# Altium project USB-ETH.PrjPcb
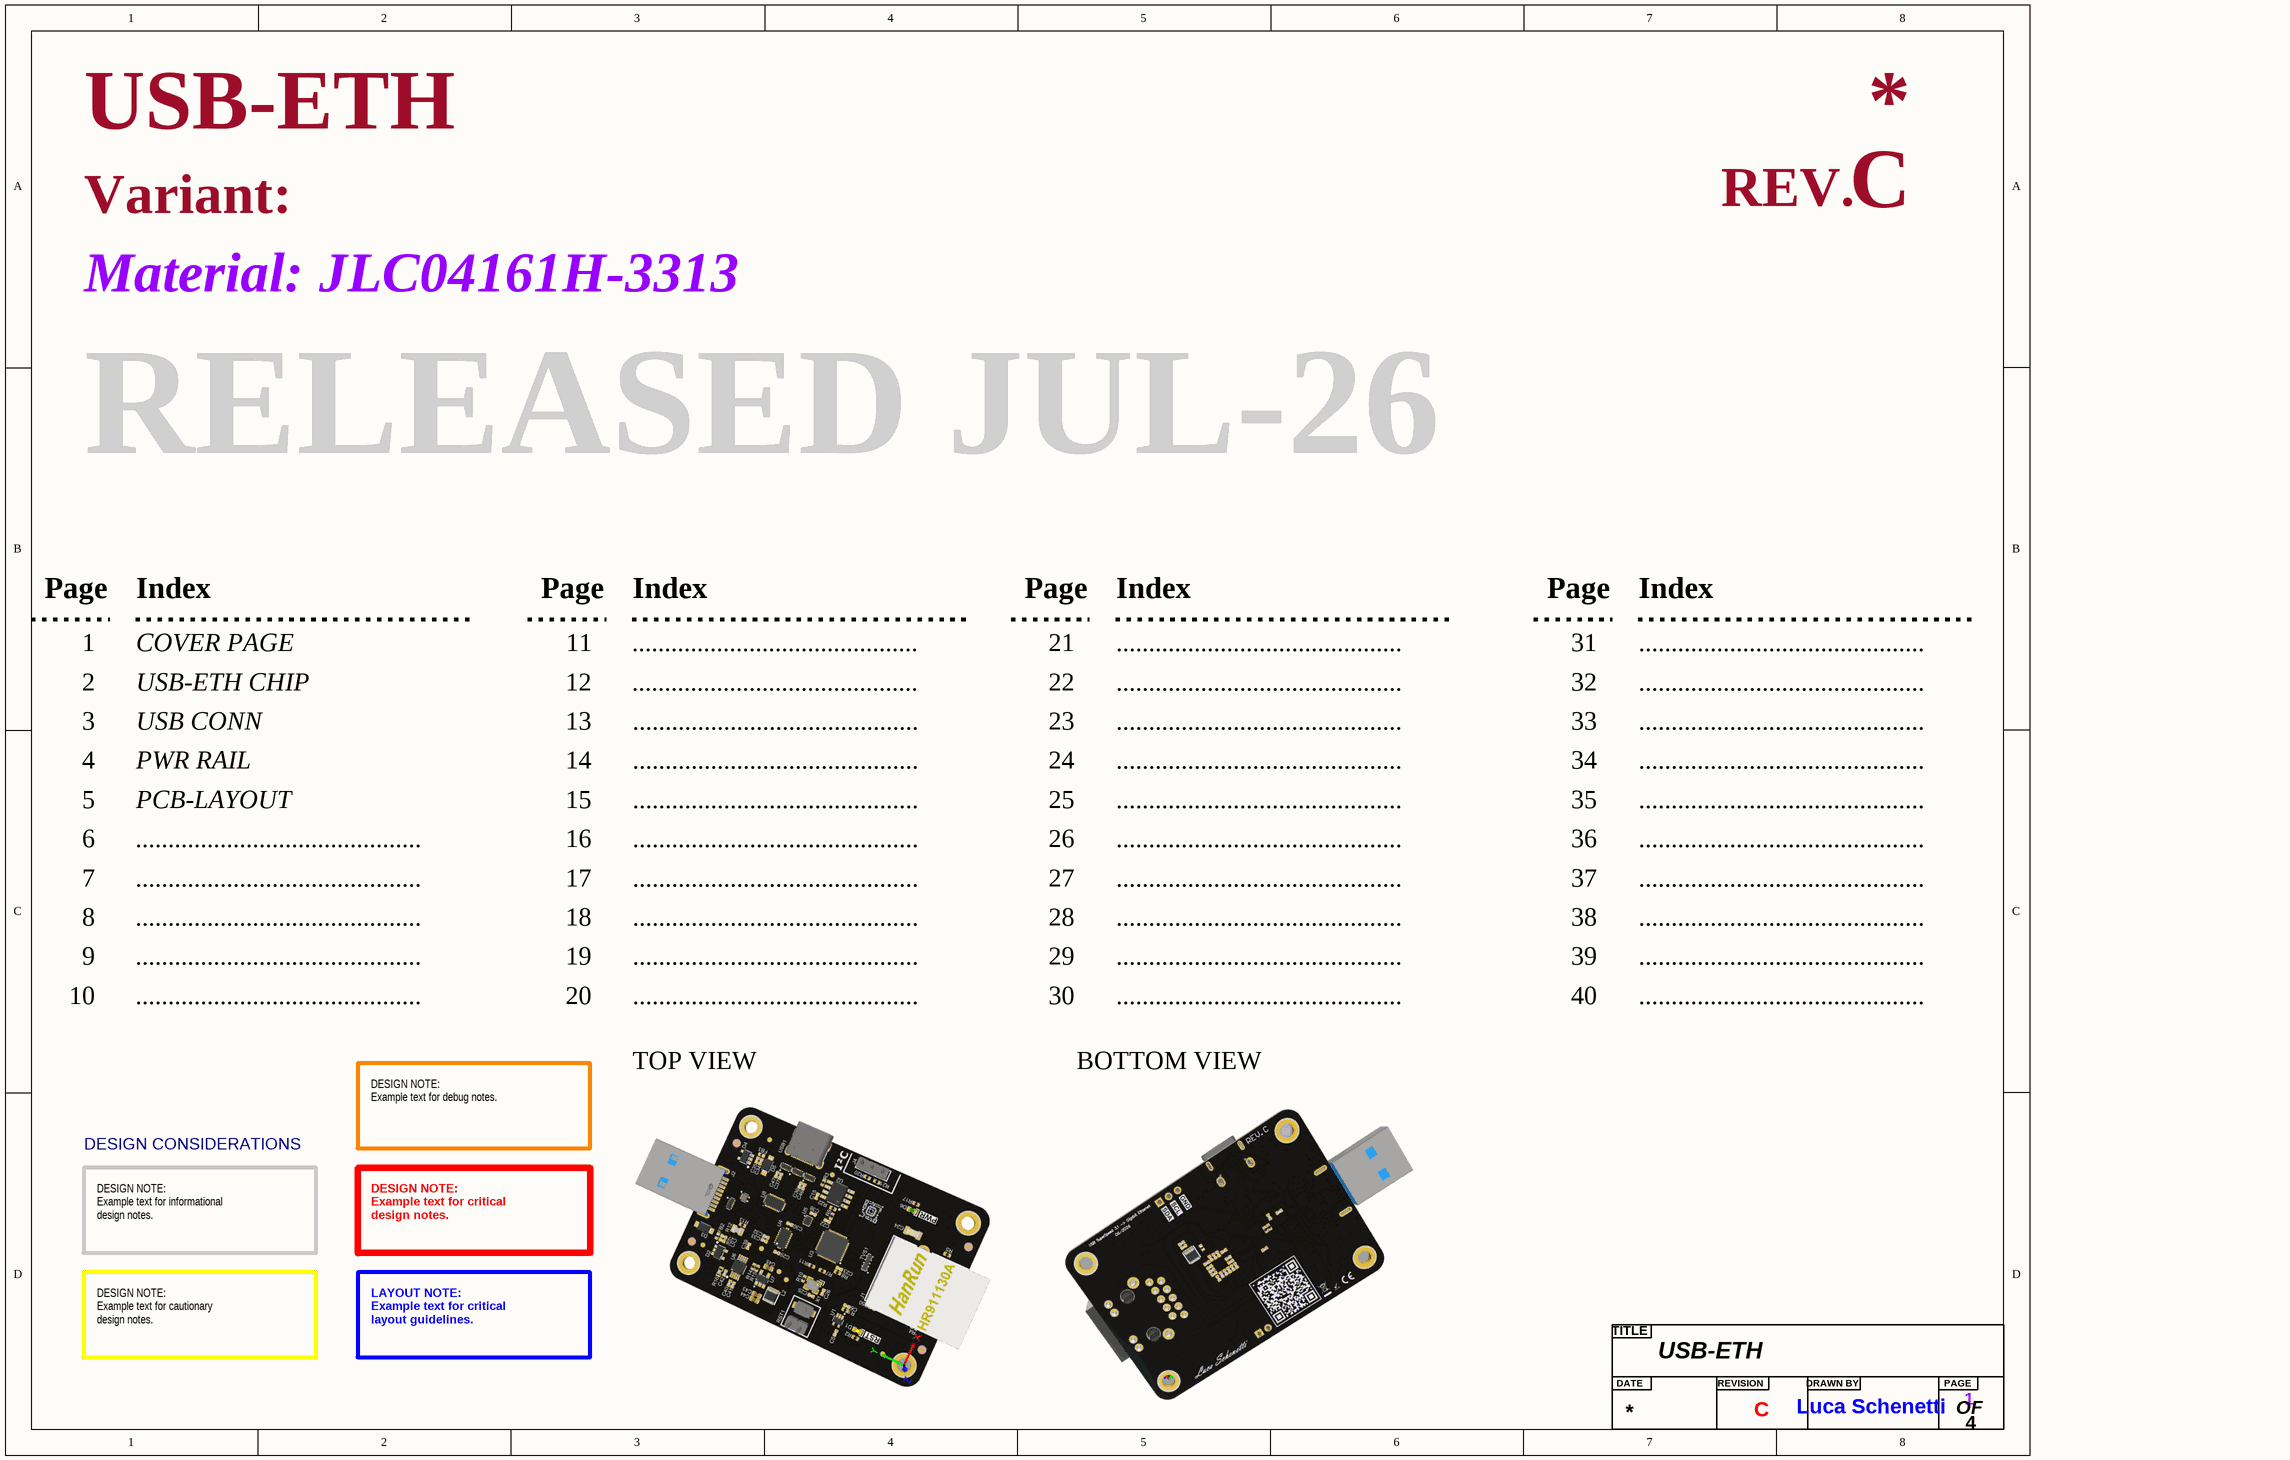
[diagram p0: COVER PAGE.SchDoc]
4 sheets, 117 parts. Net scope: flat (ports and power ports of the same name join across sheets).
Board file: PCB-LAYOUT.PcbDoc
Sheets:
  COVER PAGE.SchDoc
  USB-ETH CHIP.SchDoc
  USB CONN.SchDoc
  PWR RAIL.SchDoc

## Sheet COVER PAGE.SchDoc: USB-ETH
size A3; Author: Luca Schenetti; DrawnBy: Luca Schenetti; Revision: C; SheetNumber: 1; SheetTotal: 4; Material: JLC04161H-3313

### Parts
(Parts that share a designator on the sheet are numbered #1, #2 ... from top to bottom, then left to right.)
?#1  Title  (value not drawn)  (graphical)

### Notes on the sheet
- Variant:
- REV.
- Material:
- RELEASED JUL-26
- Page
- Index
- 1
- 2
- COVER PAGE
- USB-ETH CHIP
- 11
- 12
- ............................................
- 21
- 22
- 31
- 32
- 3
- USB CONN
- 13
- 23
- 33
- 4
- 5
- PWR RAIL
- PCB-LAYOUT
- 14
- 15
- 24
- 25
- 34
- 35
- 6
- 7
- 16
- 17
- 26
- 27
- 36
- 37
- 8
- 18
- 28
- 38
- 9
- 10
- 19
- 20
- 29
- 30
- 39
- 40
- TOP VIEW
- BOTTOM VIEW
- DESIGN CONSIDERATIONS
- DESIGN NOTE:
  Example text for debug notes.
- DESIGN NOTE:
  Example text for informational
  design notes.
- DESIGN NOTE:
  Example text for critical
  design notes.
- DESIGN NOTE:
  Example text for cautionary
  design notes.
- LAYOUT NOTE:
  Example text for critical
  layout guidelines.
- (in symbol Title) TITLE; DATE; REVISION; DRAWN BY; PAGE; OF

## Sheet USB-ETH CHIP.SchDoc: USB-ETH
size A2; Author: Luca Schenetti; DrawnBy: Luca Schenetti; Revision: C; SheetNumber: 2; SheetTotal: 4
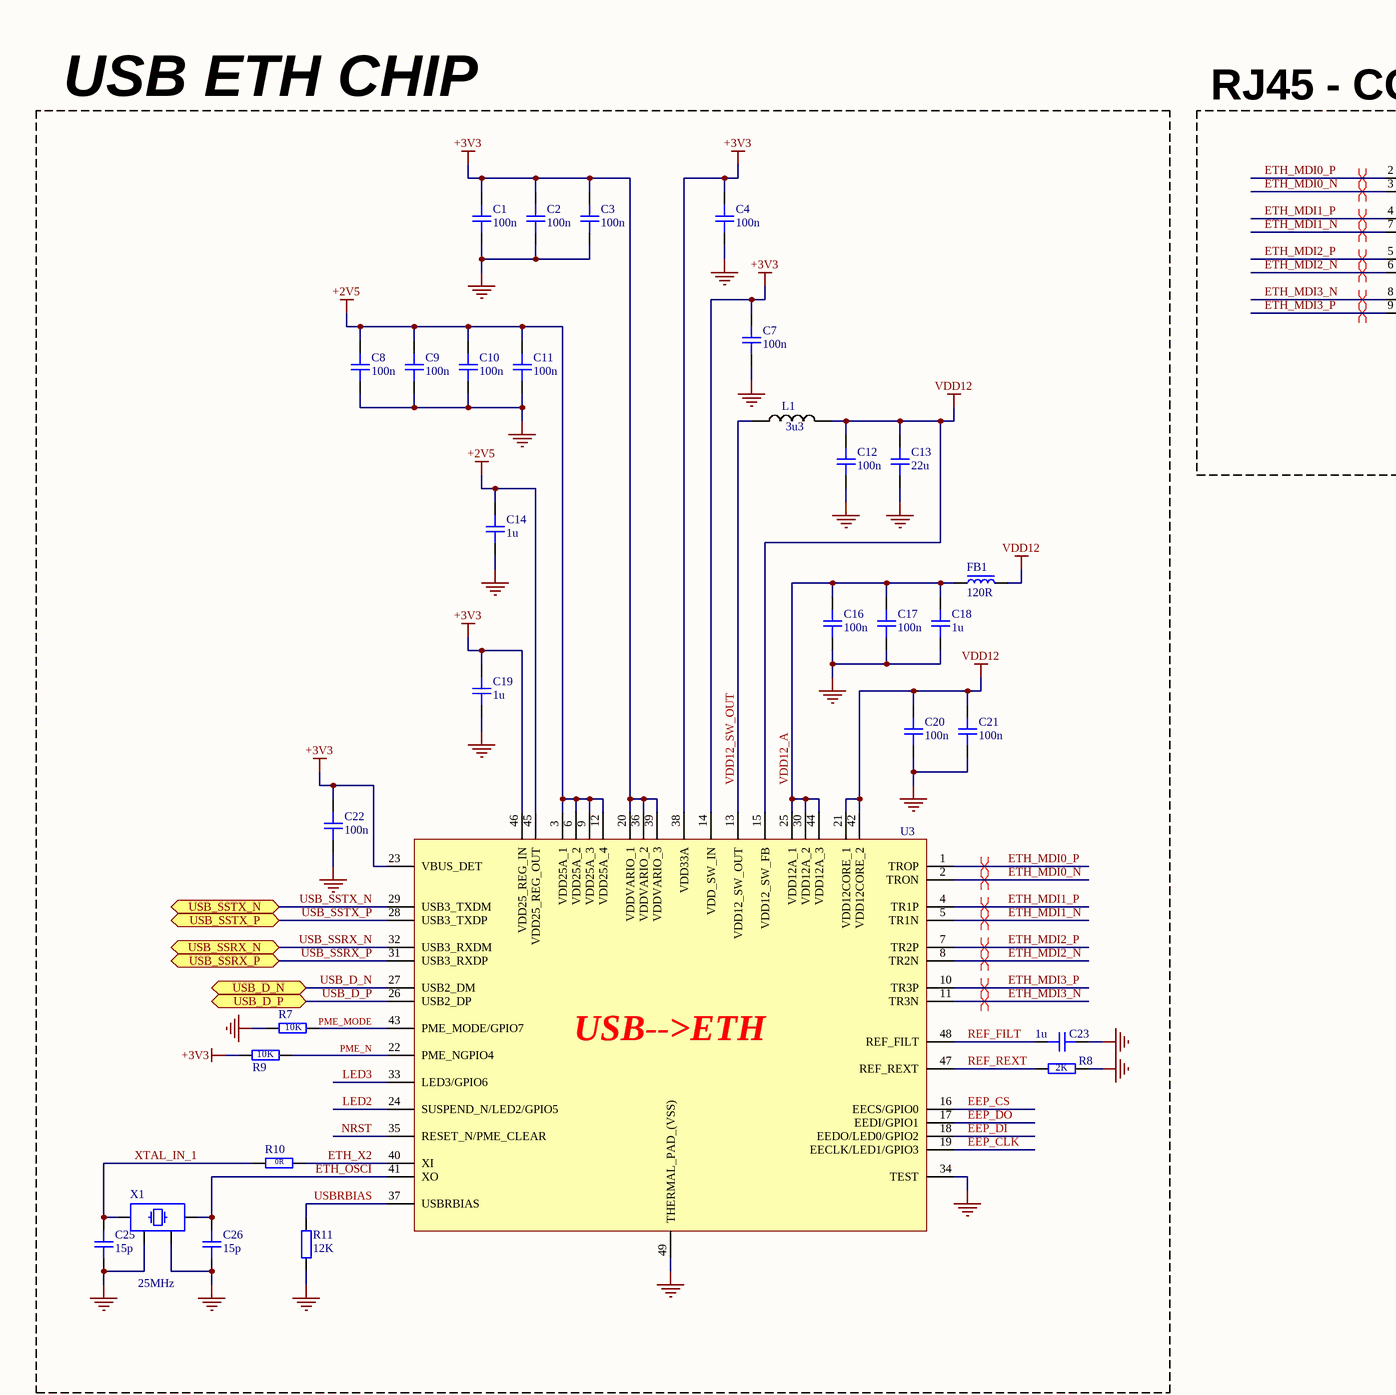
[diagram p1: USB-ETH CHIP.SchDoc, left]
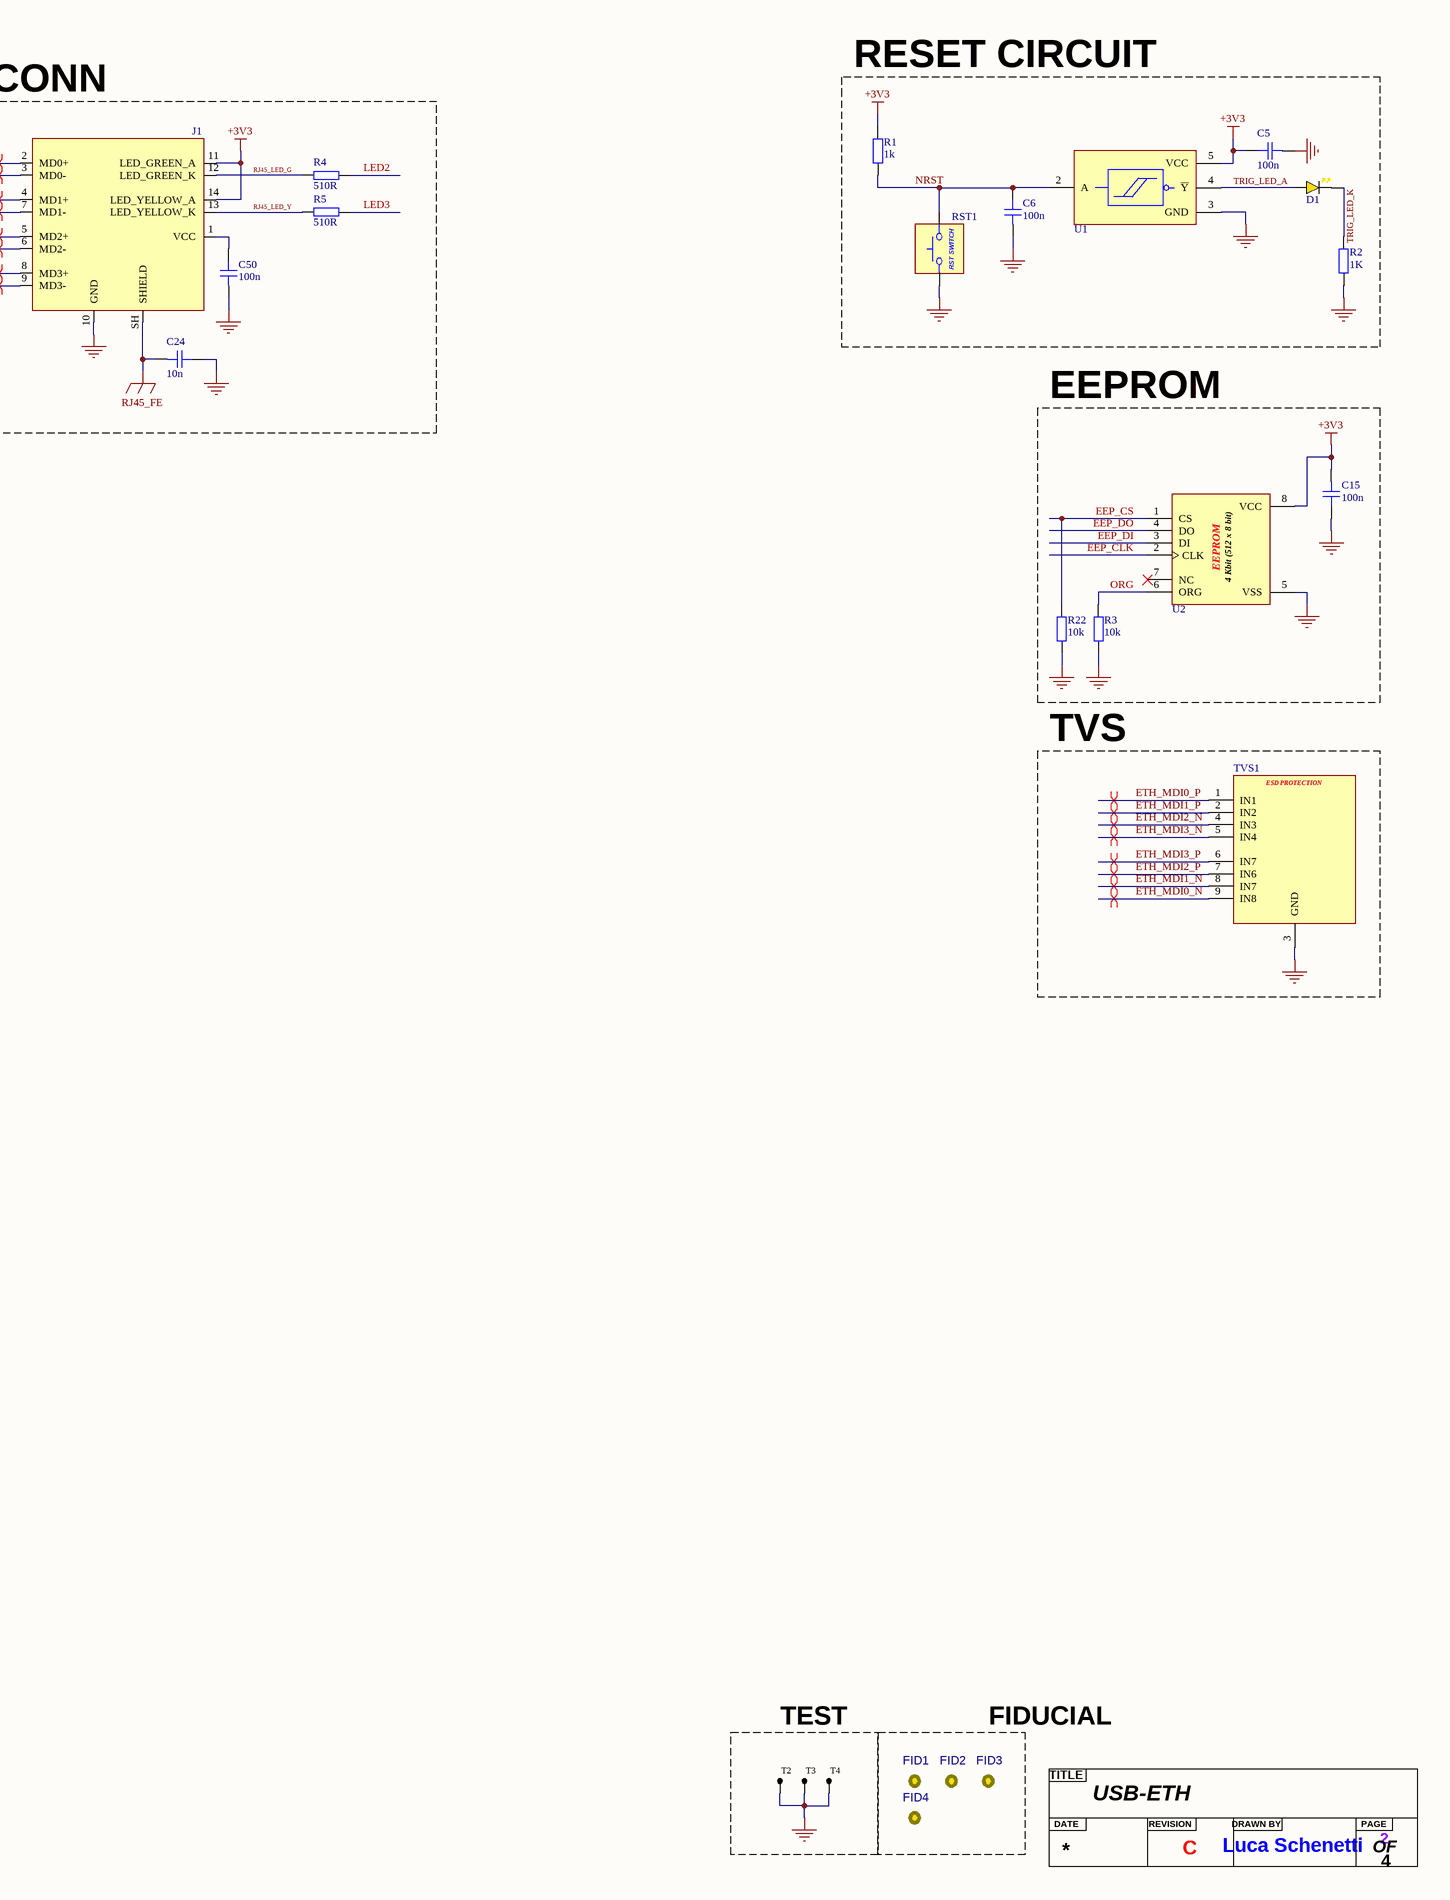
[diagram p2: USB-ETH CHIP.SchDoc, right]

### Parts
(Parts that share a designator on the sheet are numbered #1, #2 ... from top to bottom, then left to right.)
?#2  Title  (value not drawn)  (graphical)
C1  100n  [CAP_0402]
C2  100n  [CAP_0402]
C3  100n  [CAP_0402]
C4  100n  [CAP_0402]
C5  100n  [CAP_0402]
C6  100n  [CAP_0402]
C7  100n  [CAP_0402]
C8  100n  [CAP_0402]
C9  100n  [CAP_0402]
C10  100n  [CAP_0402]
C11  100n  [CAP_0402]
C12  100n  [CAP_0402]
C13  22u  [CAP_0402]
C14  1u  [CAP_0402]
C15  100n  [CAP_0402]
C16  100n  [CAP_0402]
C17  100n  [CAP_0402]
C18  1u  [CAP_0402]
C19  1u  [CAP_0402]
C20  100n  [CAP_0402]
C21  100n  [CAP_0402]
C22  100n  [CAP_0402]
C23  1u  [CAP_0402]
C24  10n  [CAP_1206]
C25  15p  [CAP_0402]
C26  15p  [CAP_0402]
C50  100n  [CAP_0402]
D1  YELLOW  [LED_0603_YELLOW]  (value not drawn)
FB1  120R  [FB_0402]
FID1  FIDUCIAL  [FIDUCIAL]  (value not drawn)  (no BOM)
FID2  FIDUCIAL  [FIDUCIAL]  (value not drawn)  (no BOM)
FID3  FIDUCIAL  [FIDUCIAL]  (value not drawn)  (no BOM)
FID4  FIDUCIAL  [FIDUCIAL]  (value not drawn)  (no BOM)
J1  100/1000Base-T RJ45 MAGJACK  [HR911130A]  (value not drawn)
L1  3u3  [INDUCTOR 1210]
R1  1k  [RES_0402]
R2  1K  [RES_0402]
R3  10k  [RES_0402]
R4  510R  [RES_0402]
R5  510R  [RES_0402]
R7  10K  [RES_0402]
R8  2K  [RES_0402]
R9  10K  [RES_0402]
R10  0R  [RES_0402]
R11  12K  [RES_0402]
R22  10k  [RES_0402]
RST1  RST_SWITCH_STM32  [RST_SWITCH]  (value not drawn)
T2  TP_S  [TP 1mm]  (value not drawn)  (no BOM)
T3  TP_S  [TP 1mm]  (value not drawn)  (no BOM)
T4  TP_S  [TP 1mm]  (value not drawn)  (no BOM)
TVS1  8-Line Ultra Low Capacitance TVS Diode Array  [RCLAMP3328P]  (value not drawn)
U1  Schmitt Trigger 1.65V~5.5V  [74LVC1G14GW,125]  (value not drawn)
U2  EEPROM 1.8V~5.5V 4Kbit SPI  [93AA66C-I/SN]  (value not drawn)
U3  ETH-USB 3.1  [LAN7800T/VSX]  (value not drawn)
X1  25MHz  [XTAL_3225]

### Blocks framed on the sheet
USB ETH CHIP: C1-C4 C7-C14 C16-C23 C25 C26 FB1 L1 R7-R11 U3 X1
RJ45 - CONN: C24 C50 J1 R4 R5
RESET CIRCUIT: C5 C6 D1 R1 R2 RST1 U1
EEPROM: C15 R3 R22 U2
TVS: TVS1
TEST: T2-T4
FIDUCIAL: FID1-FID4

### Ports
USB_D_N (bidir, see USB CONN[6B]), USB_D_P (bidir, see USB CONN[6B]), USB_SSRX_N (bidir, see USB CONN[6A]), USB_SSRX_P (bidir, see USB CONN[6A]), USB_SSTX_N (bidir, see USB CONN[6A]), USB_SSTX_P (bidir, see USB CONN[6A])

### Nets
+2V5: C8.2 C9.2 C10.2 C11.2 C14.2 U3.3(VDD25A_1) U3.6(VDD25A_2) U3.9(VDD25A_3) U3.12(VDD25A_4) U3.45(VDD25_REG_OUT)
+3V3: C1.2 C2.2 C3.2 C4.2 C5.2 C7.2 C15.1 C19.2 C22.1 J1.11(LED_GREEN_A) J1.14(LED_YELLOW_A) R1.2 R9.1 U1.5(VCC) U2.8(VCC) U3.14(VDD_SW_IN) U3.20(VDDVARIO_1) U3.23(VBUS_DET) U3.36(VDDVARIO_2) U3.38(VDD33A) U3.39(VDDVARIO_3) U3.46(VDD25_REG_IN)
GND: C1.1 C2.1 C3.1 C4.1 C5.1 C6.1 C7.1 C8.1 C9.1 C10.1 C11.1 C12.1 C13.1 C14.1 C15.2 C16.1 C17.1 C18.1 C19.1 C20.1 C21.1 C22.2 C23.1 C24.2 C25.1 C26.1 C50.1 J1.10(GND) R2.1 R3.1 R7.1 R8.2 R11.1 R22.1 RST1.1 T2.1 T3.1 T4.1 TVS1.3(GND) U1.3(GND) U2.5(VSS) U3.34(TEST) U3.49(THERMAL_PAD_(VSS)) X1.2 X1.4
RJ45_FE: C24.1 J1.SH(SHIELD)
VDD12: C12.2 C13.2 C20.2 C21.2 FB1.2 L1.2 U3.15(VDD12_SW_FB) U3.21(VDD12CORE_1) U3.42(VDD12CORE_2)
EEP_CLK: U2.2(CLK) U3.19(EECLK/LED1/GPIO3)
EEP_CS: R22.2 U2.1(CS) U3.16(EECS/GPIO0)
EEP_DI: U2.3(DI) U3.18(EEDO/LED0/GPIO2)
EEP_DO: U2.4(DO) U3.17(EEDI/GPIO1)
ETH_MDI0_N: J1.3(MD0-) TVS1.9(IN8) U3.2(TRON)
ETH_MDI0_P: J1.2(MD0+) TVS1.1(IN1) U3.1(TROP)
ETH_MDI1_N: J1.7(MD1-) TVS1.8(IN7) U3.5(TR1N)
ETH_MDI1_P: J1.4(MD1+) TVS1.2(IN2) U3.4(TR1P)
ETH_MDI2_N: J1.6(MD2-) TVS1.4(IN3) U3.8(TR2N)
ETH_MDI2_P: J1.5(MD2+) TVS1.7(IN6) U3.7(TR2P)
ETH_MDI3_N: J1.8(MD3+) TVS1.5(IN4) U3.11(TR3N)
ETH_MDI3_P: J1.9(MD3-) TVS1.6(IN7) U3.10(TR3P)
ETH_OSCI: C26.2 U3.41(XO) X1.1
ETH_X2: R10.2 U3.40(XI)
LED2: R4.2 U3.24(SUSPEND_N/LED2/GPIO5)
LED3: R5.2 U3.33(LED3/GPIO6)
NRST: C6.2 R1.1 RST1.2 U1.2(A) U3.35(RESET_N/PME_CLEAR)
ORG: R3.2 U2.6(ORG)
PME_MODE: R7.2 U3.43(PME_MODE/GPIO7)
PME_N: R9.2 U3.22(PME_NGPIO4)
REF_FILT: C23.2 U3.48(REF_FILT)
REF_REXT: R8.1 U3.47(REF_REXT)
RJ45_LED_G: J1.12(LED_GREEN_K) R4.1
RJ45_LED_Y: J1.13(LED_YELLOW_K) R5.1
TRIG_LED_A: D1.A U1.4(~{Y})
TRIG_LED_K: D1.K R2.2
USB_D_N: U3.27(USB2_DM) ; port USB_D_N
USB_D_P: U3.26(USB2_DP) ; port USB_D_P
USB_SSRX_N: U3.32(USB3_RXDM) ; port USB_SSRX_N
USB_SSRX_P: U3.31(USB3_RXDP) ; port USB_SSRX_P
USB_SSTX_N: U3.29(USB3_TXDM) ; port USB_SSTX_N
USB_SSTX_P: U3.28(USB3_TXDP) ; port USB_SSTX_P
USBRBIAS: R11.2 U3.37(USBRBIAS)
VDD12_A: C16.2 C17.2 C18.2 FB1.1 U3.25(VDD12A_1) U3.30(VDD12A_2) U3.44(VDD12A_3)
VDD12_SW_OUT: L1.1 U3.13(VDD12_SW_OUT)
XTAL_IN_1: C25.2 R10.1 X1.3
NetC50_2: C50.2 J1.1(VCC)

Not connected (* = marked no-connect by the designer): U2 7(NC)*

### Layout directives
differential pair; differential pair class DIFF_MDI_100Ω; rule Matched Net Lengths [Delay Tolerance = 50ps]: ETH_MDI0_N, ETH_MDI0_P, ETH_MDI1_N, ETH_MDI1_P, ETH_MDI2_N, ETH_MDI2_P, ETH_MDI3_N, ETH_MDI3_P

### Notes on the sheet
- (in symbol 93AA66C-I/SN) EEPROM; 4 Kbit (512 x 8 bit)
- (in symbol LAN7800T/VSX) USB-->ETH
- (in symbol RCLAMP3328P) ESD PROTECTION
- (in symbol RST_SWITCH) RST SWITCH
- (in symbol Title) TITLE; DATE; REVISION; DRAWN BY; PAGE; OF

### Library data of the parts
C1-C12 C15-C17 C20-C22 C50 = CAP_0402: [C307331]; Manufacturer: *; Manufacturer Part Number: *; Distributor Link: *; LCSC: *; Rating: *; Dielectric: *
C13 = CAP_0402: [C415703]; Manufacturer: *; Manufacturer Part Number: *; Distributor Link: *; LCSC: *; Rating: *; Dielectric: *
C14 C18 C19 C23 = CAP_0402: [C52923]; Manufacturer: *; Manufacturer Part Number: *; Distributor Link: *; LCSC: *; Rating: *; Dielectric: *
C24 = CAP_1206: [C1846]; Manufacturer: *; Manufacturer Part Number: *; Distributor Link: *; LCSC: *; Rating: *; Dielectric: *
C25 C26 = CAP_0402: Capacitor SMD 0402 [C1548]; Manufacturer: *; Manufacturer Part Number: *; Distributor Link: *; LCSC: *; Rating: *; Dielectric: *
D1 = LED_0603_YELLOW: [C89811]
FB1 = FB_0402: [C76891]; Manufacturer: *; Manufacturer Part Number: *; Distributor Link: *; LCSC: *
J1 = HR911130A: [C54408]; Manufacturer: Hanrun; Manufacturer Part Number: HR911130A
L1 = INDUCTOR 1210: [C2047622]
R1 = RES_0402: [C11702]; Manufacturer: *; Manufacturer Part Number: *; Distributor Link: *; LCSC: *
R2 = RES_0402: Resistor SMD 0402 [C11702]; Manufacturer: *; Manufacturer Part Number: *; Distributor Link: *; LCSC: *
R3 R7 R9 R22 = RES_0402: [C25744]; Manufacturer: *; Manufacturer Part Number: *; Distributor Link: *; LCSC: *
R4 R5 = RES_0402: [C25123]; Manufacturer: *; Manufacturer Part Number: *; Distributor Link: *; LCSC: *
R8 = RES_0402: [C4109]; Manufacturer: *; Manufacturer Part Number: *; Distributor Link: *; LCSC: *
R10 = RES_0402: Resistor SMD 0402 [C17168]; Manufacturer: *; Manufacturer Part Number: *; Distributor Link: *; LCSC: *
R11 = RES_0402: [C25752]; Manufacturer: *; Manufacturer Part Number: *; Distributor Link: *; LCSC: *
RST1 = RST_SWITCH: [C720477]
T2-T4 = TP_S: test point
TVS1 = RCLAMP3328P: [C28646386]
U1 = 74LVC1G14GW,125: [C265125]
U2 = 93AA66C-I/SN: [C153277]
U3 = LAN7800T/VSX: [C625082]
X1 = TSX-3225_24.0000MF15X-AC: C9006; Manufacturer: Epson; Manufacturer Part Number: TSX-3225 24.0000MF15X-AC
FID1-FID4 = FIDUCIAL: Revision: 0; Description_: FIDUCIAL; DNP: DNP

## Sheet USB CONN.SchDoc: USB-ETH
size A2; DrawnBy: Luca Schenetti; Revision: C; SheetNumber: 3; SheetTotal: 4
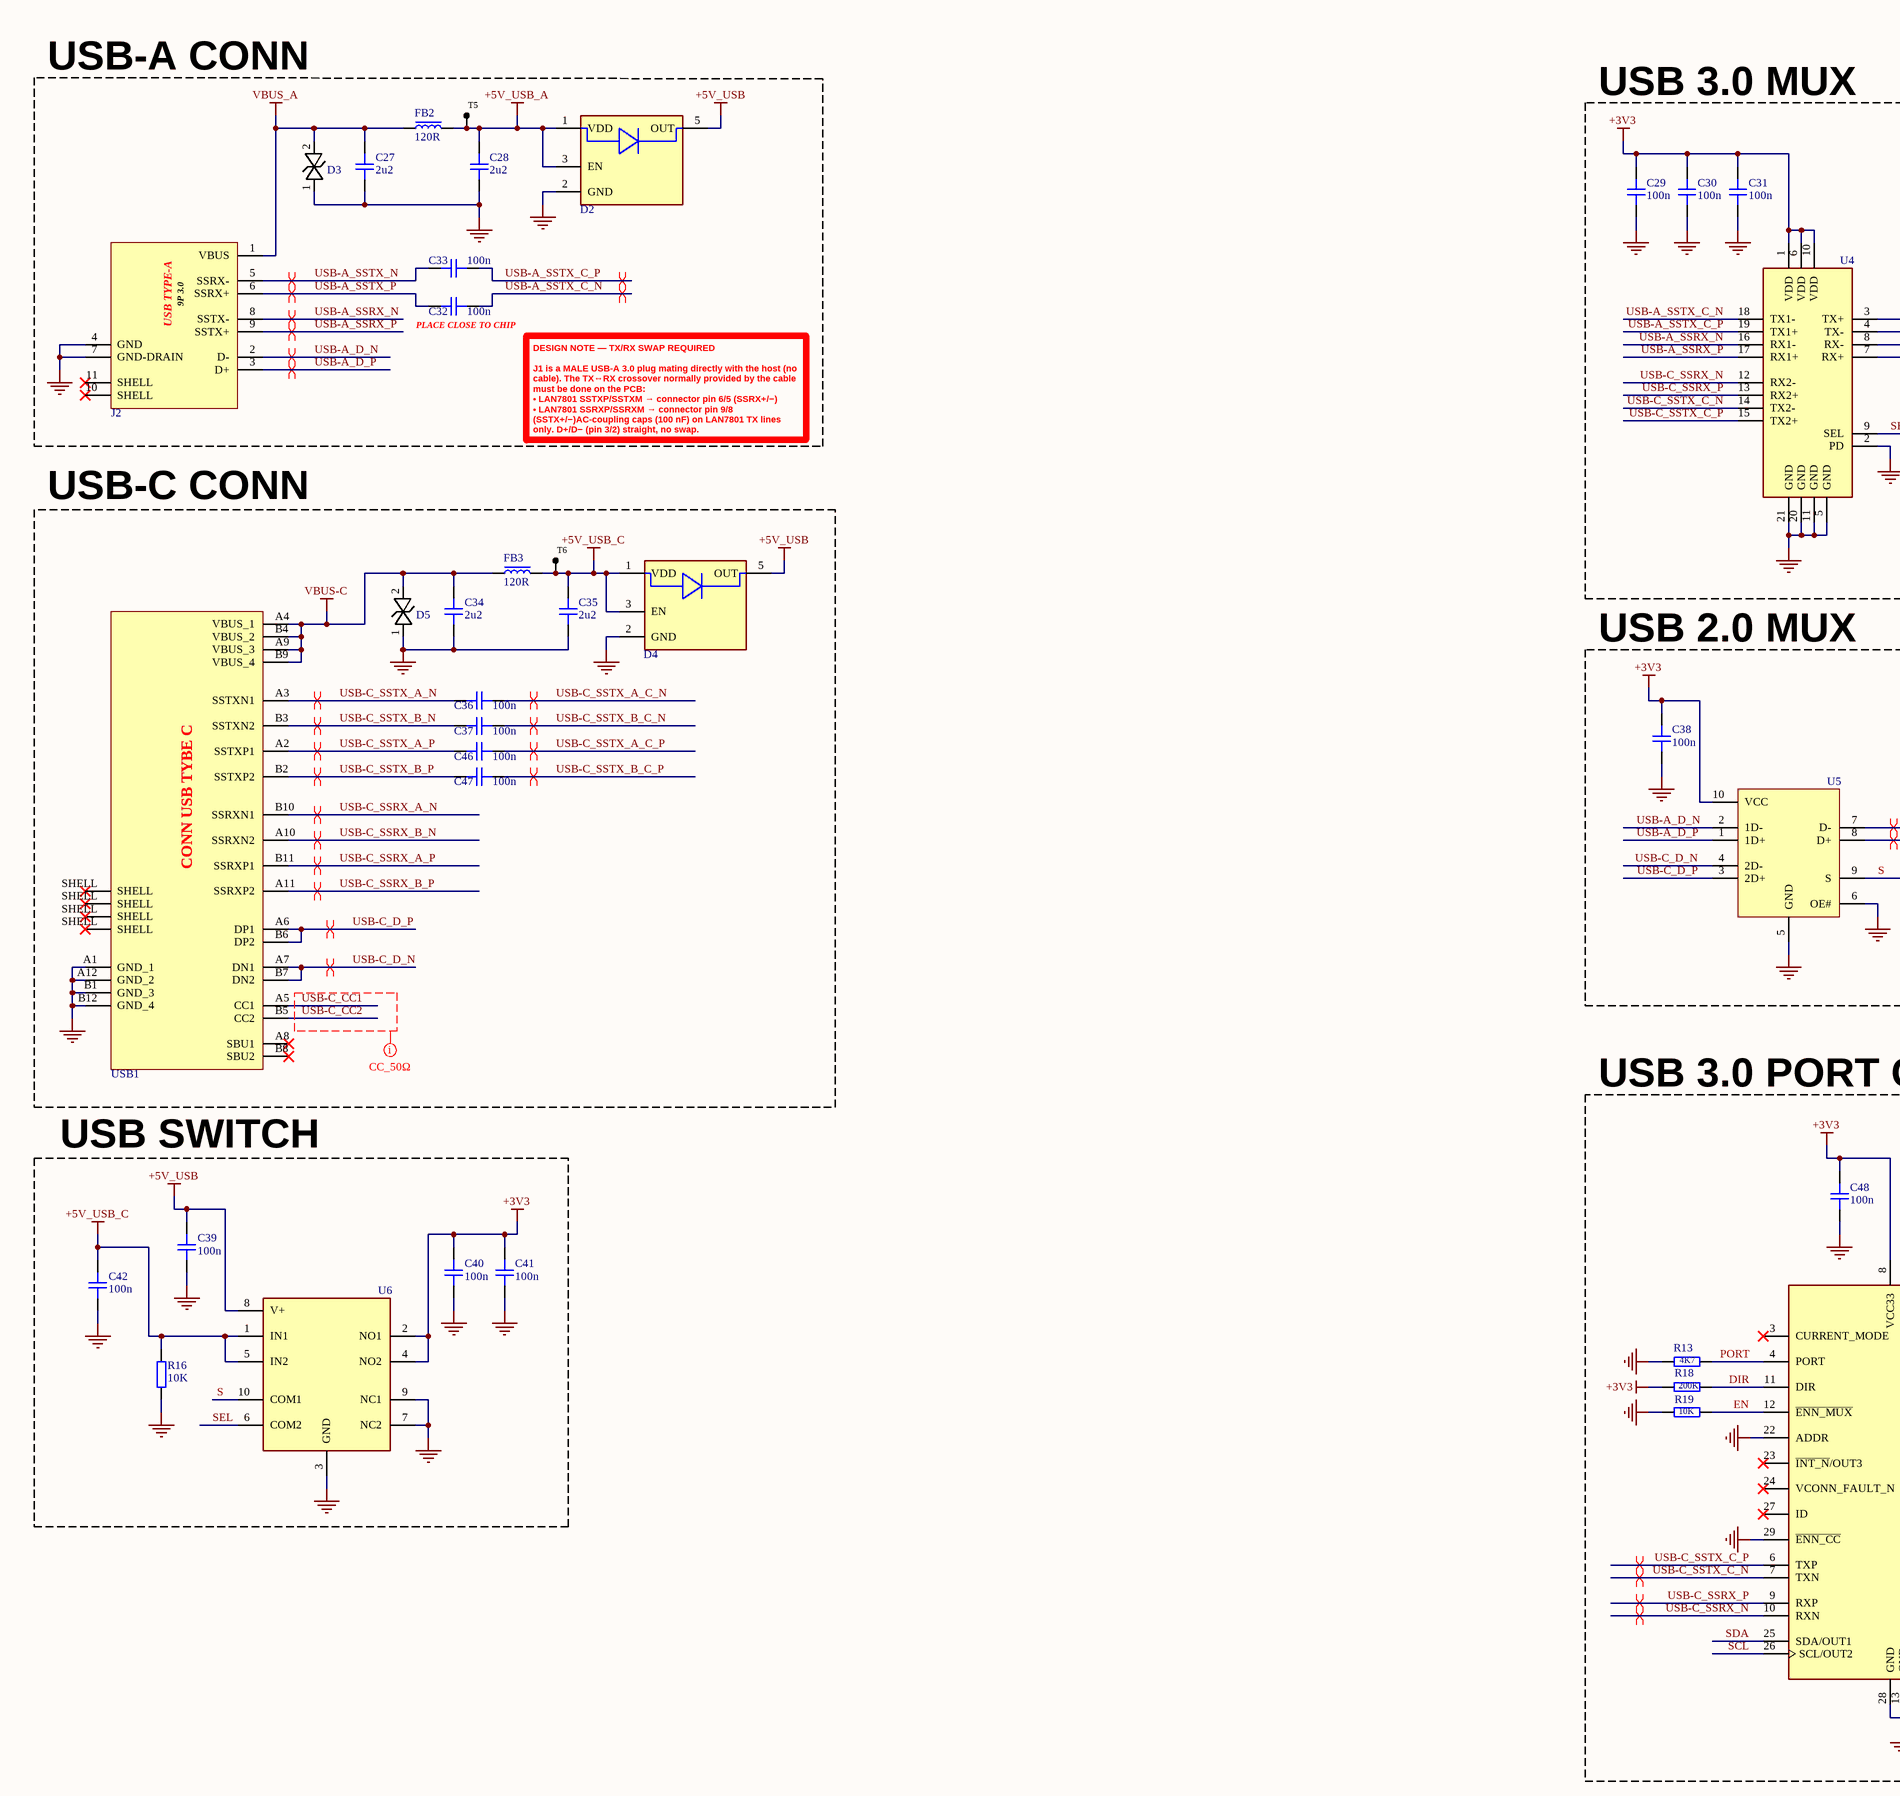
[diagram p3: USB CONN.SchDoc, left]
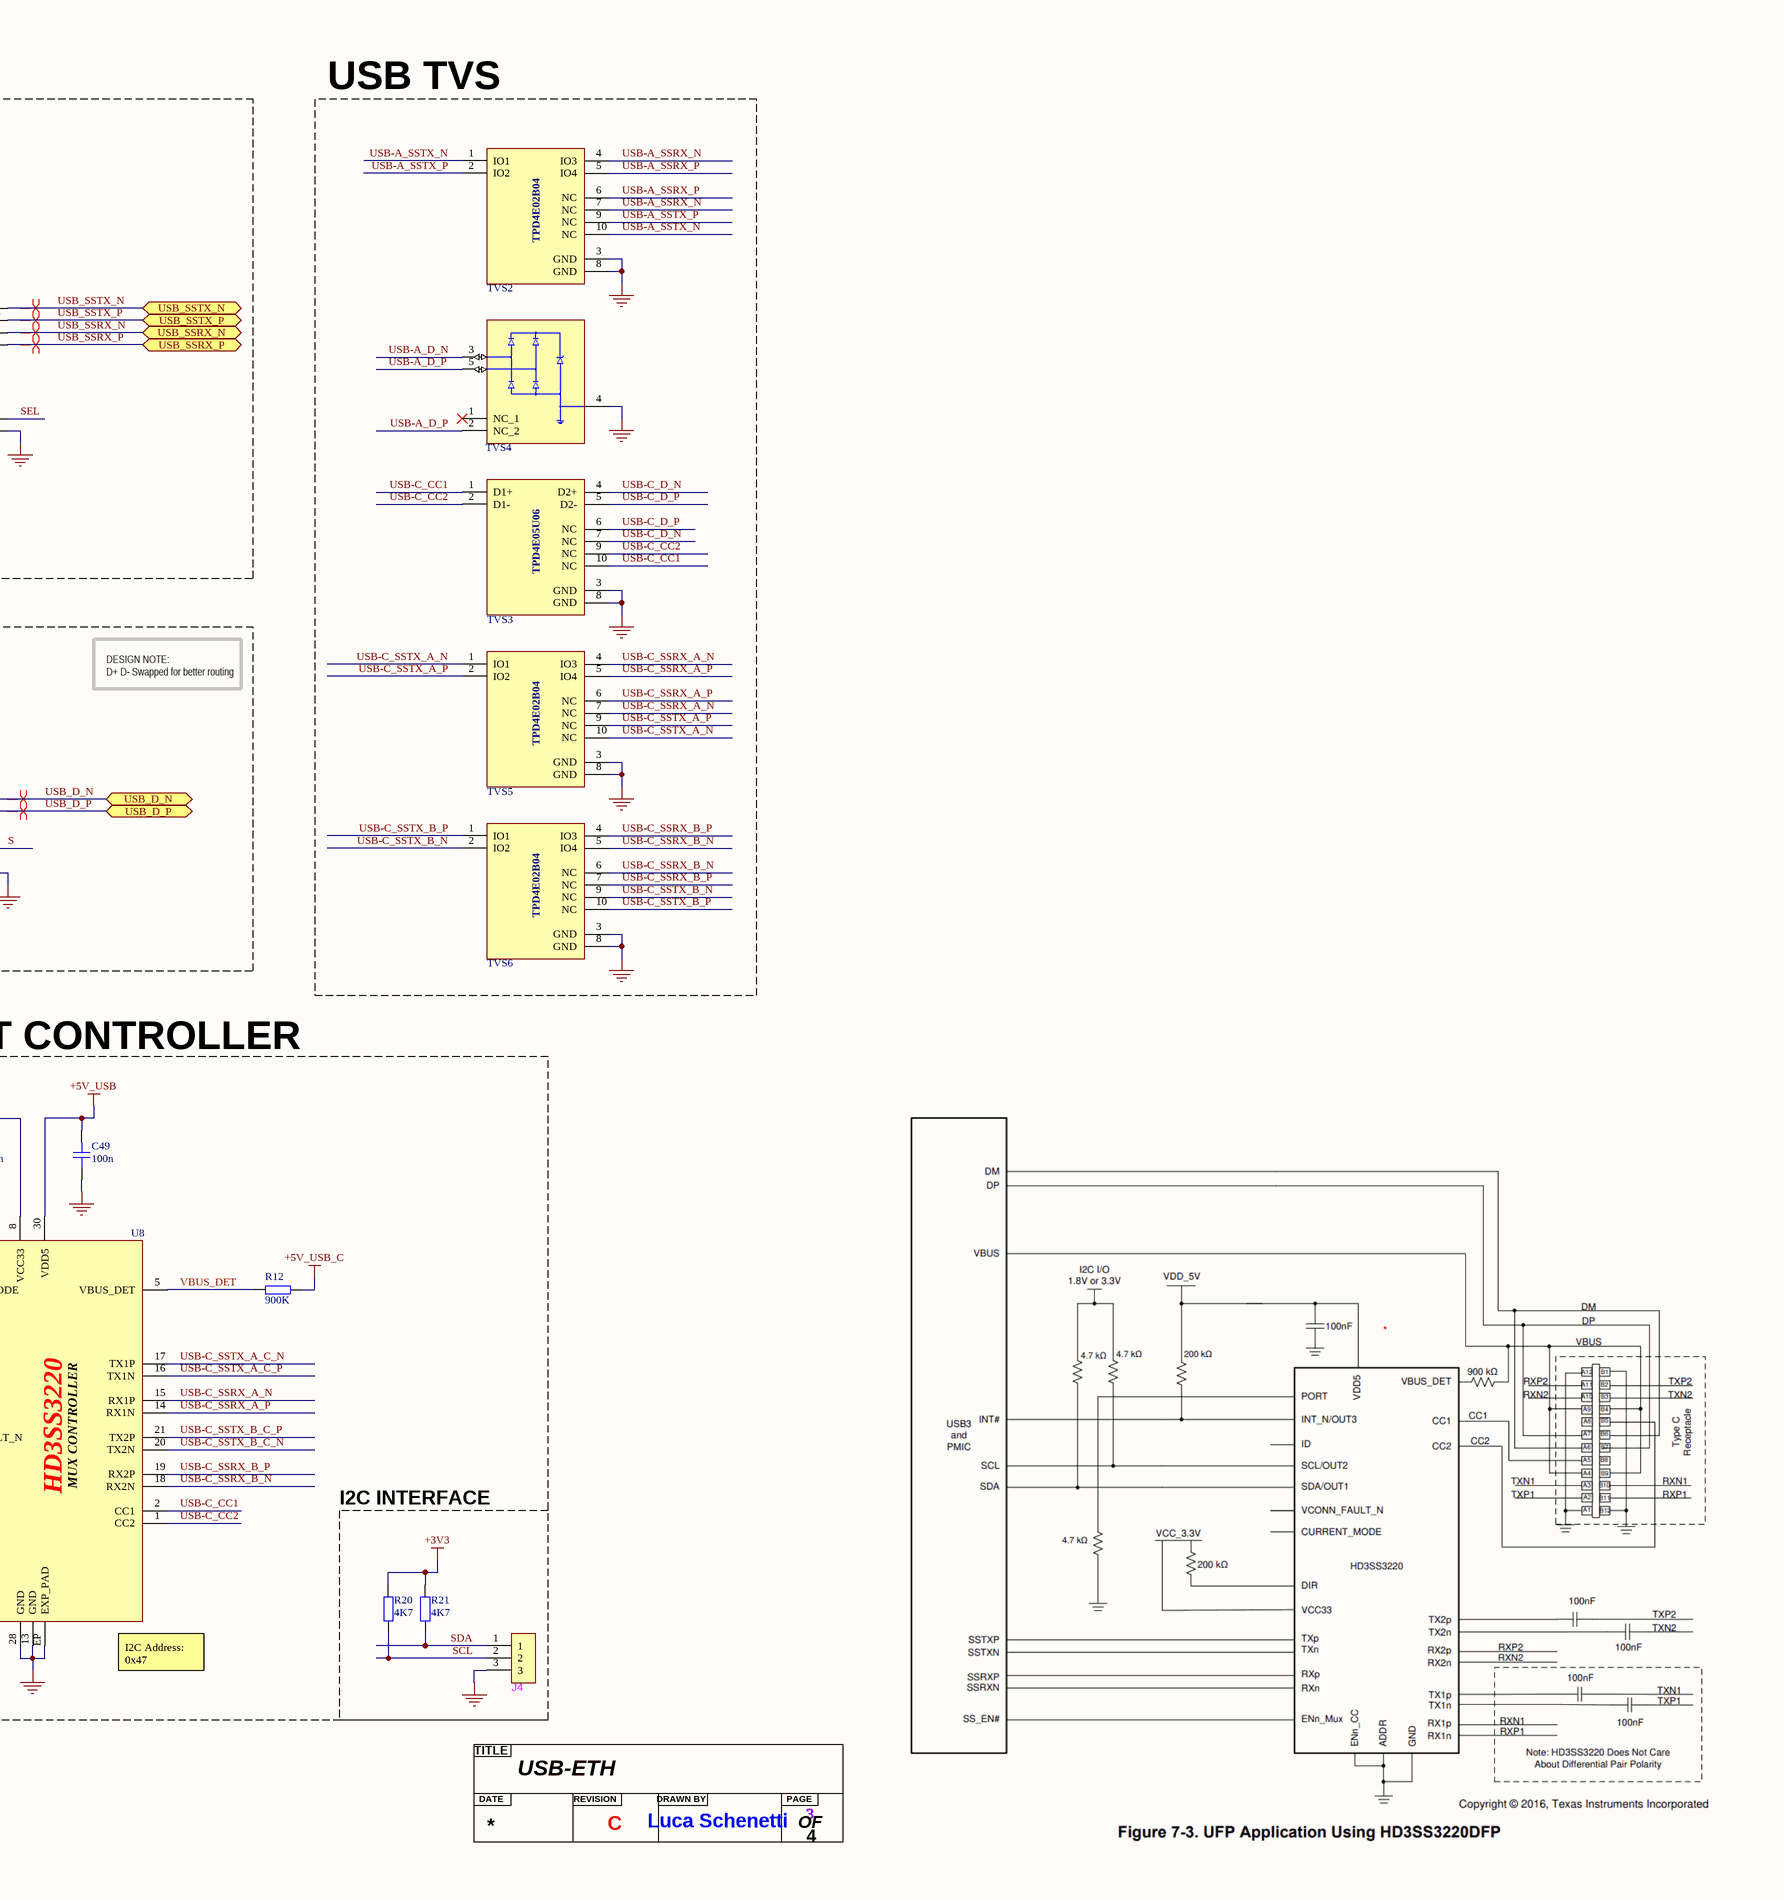
[diagram p4: USB CONN.SchDoc, right]

### Parts
(Parts that share a designator on the sheet are numbered #1, #2 ... from top to bottom, then left to right.)
?#3  Title  (value not drawn)  (graphical)
C27  2u2  [CAP_0402]
C28  2u2  [CAP_0402]
C29  100n  [CAP_0402]
C30  100n  [CAP_0402]
C31  100n  [CAP_0402]
C32  100n  [CAP_0402]
C33  100n  [CAP_0402]
C34  2u2  [CAP_0402]
C35  2u2  [CAP_0402]
C36  100n  [CAP_0402]
C37  100n  [CAP_0402]
C38  100n  [CAP_0402]
C39  100n  [CAP_0402]
C40  100n  [CAP_0402]
C41  100n  [CAP_0402]
C42  100n  [CAP_0402]
C46  100n  [CAP_0402]
C47  100n  [CAP_0402]
C48  100n  [CAP_0402]
C49  100n  [CAP_0402]
D2  IDEAL DIODE 1A  [MAX40200AUK+T]  (value not drawn)
D3  ESD Protection TVS 6.0V  [SMF6.0CA]  (value not drawn)
D4  IDEAL DIODE 1A  [MAX40200AUK+T]  (value not drawn)
D5  ESD Protection TVS 6.0V  [SMF6.0CA]  (value not drawn)
FB2  120R  [FB_0402]
FB3  120R  [FB_0402]
J2  USB-A MALE 9P  [HC-USB3.0-C26]  (value not drawn)
J4  2.54mm 3P  [2.54mm 3P]  (value not drawn)  (no BOM)
R12  900K  [RES_0805]
R13  4K7  [RES_0402]
R16  10K  [RES_0603]
R18  200K  [RES_0402]
R19  10K  [RES_0402]
R20  4K7  [RES_0402]
R21  4K7  [RES_0402]
T5  TP_S  [TP 1mm]  (value not drawn)  (no BOM)
T6  TP_S  [TP 1mm]  (value not drawn)  (no BOM)
TVS2  TVS DIODE USB 3  [TPD4E02B04DQAR]  (value not drawn)
TVS3  ESD and Surge Protection USB, HDMI & High Speed  [TPD4E05U06DQAR]  (value not drawn)
TVS4  TVS USB 2.0 ±25-kV  [TPD2E2U06DRLR]  (value not drawn)
TVS5  TVS DIODE USB 3  [TPD4E02B04DQAR]  (value not drawn)
TVS6  TVS DIODE USB 3  [TPD4E02B04DQAR]  (value not drawn)
U4  MUX USB 3.0  [PI3USB302-AZBEX]  (value not drawn)
U5  MUX USB2.0  [TS3USB221ARSER]  (value not drawn)
U6  Analog Switches, Multiplexers  [TS5A23157DGSR]  (value not drawn)
U8  USB Type-C MUX CONTROLLER  [HD3SS3220]  (value not drawn)
USB1  USB-C 24P SMD  [TYPE-C 24P QT 143]  (value not drawn)

### Blocks framed on the sheet
USB-A CONN: C27 C28 C32 C33 D2 D3 FB2 J2 T5
USB 3.0 MUX: C29-C31 U4
USB TVS: TVS2-TVS6
USB-C CONN: C34-C37 C46 C47 D4 D5 FB3 T6 USB1
USB 2.0 MUX: C38 U5
USB 3.0 PORT CONTROLLER: C48 C49 R12 R13 R18 R19 U8
USB SWITCH: C39-C42 R16 U6
I2C INTERFACE: J4 R20 R21

### Ports
USB_D_N (bidir, see USB-ETH CHIP[1B]), USB_D_P (bidir, see USB-ETH CHIP[1B]), USB_SSRX_N (bidir, see USB-ETH CHIP[1B]), USB_SSRX_P (bidir, see USB-ETH CHIP[1B]), USB_SSTX_N (bidir, see USB-ETH CHIP[1B]), USB_SSTX_P (bidir, see USB-ETH CHIP[1B])

### Nets
+3V3: C29.1 C30.1 C31.1 C38.1 C40.1 C41.1 C48.1 R18.1 R20.2 R21.2 U4.1(VDD) U4.6(VDD) U4.10(VDD) U5.10(VCC) U6.2(NO1) U6.4(NO2) U8.8(VCC33)
+5V_USB: C39.1 C49.1 D2.5(OUT) D4.5(OUT) U6.8(V+) U8.30(VDD5)
+5V_USB_A: C28.2 D2.1(VDD) D2.3(EN) FB2.2 T5.1
+5V_USB_C: C35.2 C42.1 D4.1(VDD) D4.3(EN) FB3.2 R12.2 R16.2 T6.1 U6.1(IN1) U6.5(IN2)
GND: C27.1 C28.1 C29.2 C30.2 C31.2 C34.1 C35.1 C38.2 C39.2 C40.2 C41.2 C42.2 C48.2 C49.2 D2.2(GND) D3.1 D4.2(GND) D5.1 J2.4(GND) J2.7(GND-DRAIN) J4.3 R13.2 R16.1 R19.1 TVS2.3(GND) TVS2.8(GND) TVS3.3(GND) TVS3.8(GND) TVS4.4(GND) TVS5.3(GND) TVS5.8(GND) TVS6.3(GND) TVS6.8(GND) U4.2(PD) U4.5(GND) U4.11(GND) U4.20(GND) U4.21(GND) U5.5(GND) U5.6(OE#) U6.3(GND) U6.7(NC2) U6.9(NC1) U8.13(GND) U8.22(ADDR) U8.28(GND) U8.29(~{ENN_CC}) U8.EP(EXP_PAD) USB1.A1(GND_1) USB1.A12(GND_2) USB1.B1(GND_3) USB1.B12(GND_4)
VBUS-C: C34.2 D5.2 FB3.1 USB1.A4(VBUS_1) USB1.A9(VBUS_3) USB1.B4(VBUS_2) USB1.B9(VBUS_4)
VBUS_A: C27.2 D3.2 FB2.1 J2.1(VBUS)
DIR: R18.2 U8.11(DIR)
EN: R19.2 U8.12(~{ENN_MUX})
PORT: R13.1 U8.4(PORT)
S: U5.9(S) U6.10(COM1)
SCL: J4.2 R20.1 U8.26(SCL/OUT2)
SDA: J4.1 R21.1 U8.25(SDA/OUT1)
SEL: U4.9(SEL) U6.6(COM2)
USB-A_D_N: J2.2(D-) TVS4.3(IO1) U5.2(1D-)
USB-A_D_P: J2.3(D+) TVS4.2(NC_2) TVS4.5(IO2) U5.1(1D+)
USB-A_SSRX_N: J2.8(SSTX-) TVS2.4(IO3) TVS2.7(NC) U4.16(RX1-)
USB-A_SSRX_P: J2.9(SSTX+) TVS2.5(IO4) TVS2.6(NC) U4.17(RX1+)
USB-A_SSTX_C_N: C32.2 U4.18(TX1-)
USB-A_SSTX_C_P: C33.2 U4.19(TX1+)
USB-A_SSTX_N: C33.1 J2.5(SSRX-) TVS2.1(IO1) TVS2.10(NC)
USB-A_SSTX_P: C32.1 J2.6(SSRX+) TVS2.2(IO2) TVS2.9(NC)
USB-C_CC1: TVS3.1(D1+) TVS3.10(NC) U8.2(CC1) USB1.A5(CC1)
USB-C_CC2: TVS3.2(D1-) TVS3.9(NC) U8.1(CC2) USB1.B5(CC2)
USB-C_D_N: TVS3.4(D2+) TVS3.7(NC) U5.4(2D-) USB1.A7(DN1) USB1.B7(DN2)
USB-C_D_P: TVS3.5(D2-) TVS3.6(NC) U5.3(2D+) USB1.A6(DP1) USB1.B6(DP2)
USB-C_SSRX_A_N: TVS5.4(IO3) TVS5.7(NC) U8.15(RX1P) USB1.B10(SSRXN1)
USB-C_SSRX_A_P: TVS5.5(IO4) TVS5.6(NC) U8.14(RX1N) USB1.B11(SSRXP1)
USB-C_SSRX_B_N: TVS6.5(IO4) TVS6.6(NC) U8.18(RX2N) USB1.A10(SSRXN2)
USB-C_SSRX_B_P: TVS6.4(IO3) TVS6.7(NC) U8.19(RX2P) USB1.A11(SSRXP2)
USB-C_SSRX_N: U4.12(RX2-) U8.10(RXN)
USB-C_SSRX_P: U4.13(RX2+) U8.9(RXP)
USB-C_SSTX_A_C_N: C36.2 U8.17(TX1P)
USB-C_SSTX_A_C_P: C46.2 U8.16(TX1N)
USB-C_SSTX_A_N: C36.1 TVS5.1(IO1) TVS5.10(NC) USB1.A3(SSTXN1)
USB-C_SSTX_A_P: C46.1 TVS5.2(IO2) TVS5.9(NC) USB1.A2(SSTXP1)
USB-C_SSTX_B_C_N: C37.2 U8.20(TX2N)
USB-C_SSTX_B_C_P: C47.2 U8.21(TX2P)
USB-C_SSTX_B_N: C37.1 TVS6.2(IO2) TVS6.9(NC) USB1.B3(SSTXN2)
USB-C_SSTX_B_P: C47.1 TVS6.1(IO1) TVS6.10(NC) USB1.B2(SSTXP2)
USB-C_SSTX_C_N: U4.14(TX2-) U8.7(TXN)
USB-C_SSTX_C_P: U4.15(TX2+) U8.6(TXP)
USB_D_N: U5.7(D-) ; port USB_D_N
USB_D_P: U5.8(D+) ; port USB_D_P
USB_SSRX_N: U4.8(RX-) ; port USB_SSRX_N
USB_SSRX_P: U4.7(RX+) ; port USB_SSRX_P
USB_SSTX_N: U4.3(TX+) ; port USB_SSTX_N
USB_SSTX_P: U4.4(TX-) ; port USB_SSTX_P
VBUS_DET: R12.1 U8.5(VBUS_DET)

Not connected (* = marked no-connect by the designer): J2 10(SHELL)* 11(SHELL)*; TVS4 1(NC_1)*; U8 3(CURRENT_MODE)* 23(~{INT_N}/OUT3)* 24(VCONN_FAULT_N)* 27(ID)*; USB1 A8(SBU1)* B8(SBU2)* SHELL*

### Layout directives
differential pair; differential pair class DIFF_USB_90Ω: USB-A_D_N, USB-A_D_P, USB-A_SSRX_N, USB-A_SSRX_P, USB-A_SSTX_C_N, USB-A_SSTX_C_P, USB-A_SSTX_N, USB-A_SSTX_P, USB-C_D_N, USB-C_D_P, USB-C_SSRX_A_N, USB-C_SSRX_A_P, USB-C_SSRX_B_N, USB-C_SSRX_B_P, USB-C_SSRX_N, USB-C_SSRX_P, USB-C_SSTX_A_C_N, USB-C_SSTX_A_C_P, USB-C_SSTX_A_N, USB-C_SSTX_A_P, USB-C_SSTX_B_C_N, USB-C_SSTX_B_C_P, USB-C_SSTX_B_N, USB-C_SSTX_B_P, USB-C_SSTX_C_N, USB-C_SSTX_C_P, USB_D_N, USB_D_P, USB_SSRX_N, USB_SSRX_P, USB_SSTX_N, USB_SSTX_P
net class CC_50Ω: USB-C_CC1, USB-C_CC2

### Notes on the sheet
- (near C32) PLACE CLOSE TO CHIP
- DESIGN NOTE — TX/RX SWAP REQUIRED
  J1 is a MALE USB-A 3.0 plug mating directly with the host (no cable). The TX↔RX crossover normally provided by the cable must be done on the PCB:
  • LAN7801 SSTXP/SSTXM → connector pin 6/5 (SSRX+/−)
  • LAN7801 SSRXP/SSRXM → connector pin 9/8 (SSTX+/−)AC-coupling caps (100 nF) on LAN7801 TX lines only. D+/D− (pin 3/2) straight, no swap.
- DESIGN NOTE:
  D+ D- Swapped for better routing
- (near U8) I2C Address:
  0x47
- (in symbol HC-USB3.0-C26) USB TYPE-A; 9P 3.0
- (in symbol HD3SS3220RNHR) HD3SS3220; MUX CONTROLLER
- (in symbol Title) TITLE; DATE; REVISION; DRAWN BY; PAGE; OF
- (in symbol TPD4E02B04DQAR) TPD4E02B04
- (in symbol TPD4E05U06DQAR) TPD4E05U06
- (in symbol USB-C 24P) CONN USB TYBE C

### Library data of the parts
C27 C28 C34 C35 = CAP_0402: [C12530]; Manufacturer: *; Manufacturer Part Number: *; Distributor Link: *; LCSC: *; Rating: *; Dielectric: *
C29-C31 C38-C42 = CAP_0402: [C307331]; Manufacturer: *; Manufacturer Part Number: *; Distributor Link: *; LCSC: *; Rating: *; Dielectric: *
C32 C33 C36 C37 C46 C47 = CAP_0402: Capacitor SMD 0402[C1525]; Manufacturer: *; Manufacturer Part Number: *; Distributor Link: *; LCSC: *; Rating: *; Dielectric: *
C48 C49 = CAP_0402: C307331; Manufacturer: *; Manufacturer Part Number: *; Distributor Link: *; LCSC: *; Rating: *; Dielectric: *
D2 D4 = MAX40200AUK+T: [C2649430]
D3 D5 = SMF6.0CA: [C123791]
FB2 FB3 = FB_0402: [C76891]; Manufacturer: *; Manufacturer Part Number: *; Distributor Link: *; LCSC: *
J2 = HC-USB3.0-C26: [C7501854]
J4 = 2.54mm 3P: [C6332196]; Manufacturer: HANBO(汉博); Symbol: HB-PH3-25413PB2GOP; Add into BOM: yes; Pin Structure: 1x3P; Circluar Pins/Square Pins: Square Pins; Current Rating (Max): 3A; Voltage Rating (Max): 250V; Soldering Temperature(Max): 260℃; Device: HB-PH3-25413PB2GOP; LCSC Part Name: 间距:2.54mm 1x3P 直插 方针; Supplier Part: C6332196; Manufacturer Part: HB-PH3-25413PB2GOP; Supplier Footprint: 插件,P=2.54mm; JLCPCB Part Class: Extended Part; Datasheet: https://atta.szlcsc.com/upload/public/pdf/source/20230803/F72D259687963761DF1B552F3BB84A31.pdf; Supplier: LCSC; Convert to PCB: yes; Pitch: 2.54mm; Row Spacing: 2.54mm; Mounting Type: Straight; Number of Rows: Plugin; Number of Pins: 3P; Length of Mating Pin: 6mm; Insulation Height: 2.54mm; Length of End Connection Pin: 3mm; Contact Plating: Gold; Operating Temperature Range: -40℃~+105℃; Color: Black
R12 = RES_0805: [C52209984]; Manufacturer: *; Manufacturer Part Number: *; Distributor Link: *; LCSC: *
R13 R20 R21 = RES_0402: [C25900]; Manufacturer: *; Manufacturer Part Number: *; Distributor Link: *; LCSC: *
R16 = RES_0603: [C25804]; Manufacturer: *; Manufacturer Part Number: *; Distributor Link: *; LCSC: *
R18 = RES_0402: [C25764]; Manufacturer: *; Manufacturer Part Number: *; Distributor Link: *; LCSC: *
R19 = RES_0402: [C25744]; Manufacturer: *; Manufacturer Part Number: *; Distributor Link: *; LCSC: *
T5 T6 = TP_S: test point
TVS2 TVS5 TVS6 = TPD4E02B04DQAR: [C106794]
TVS3 = TPD4E05U06DQAR: [C138714]
TVS4 = TPD2E2U06DRLR: [C1972959]
U4 = PI3USB302-AZBEX: [C500787]
U5 = TS3USB221ARSER: [C128396]
U6 = TS5A23157DGSR: [C11133]
U8 = HD3SS3220RNHR: [C165155]
USB1 = USB-C 24P: [C5156605]

## Sheet PWR RAIL.SchDoc: USB-ETH
size A4; DrawnBy: Luca Schenetti; Revision: C; SheetNumber: 4; SheetTotal: 4
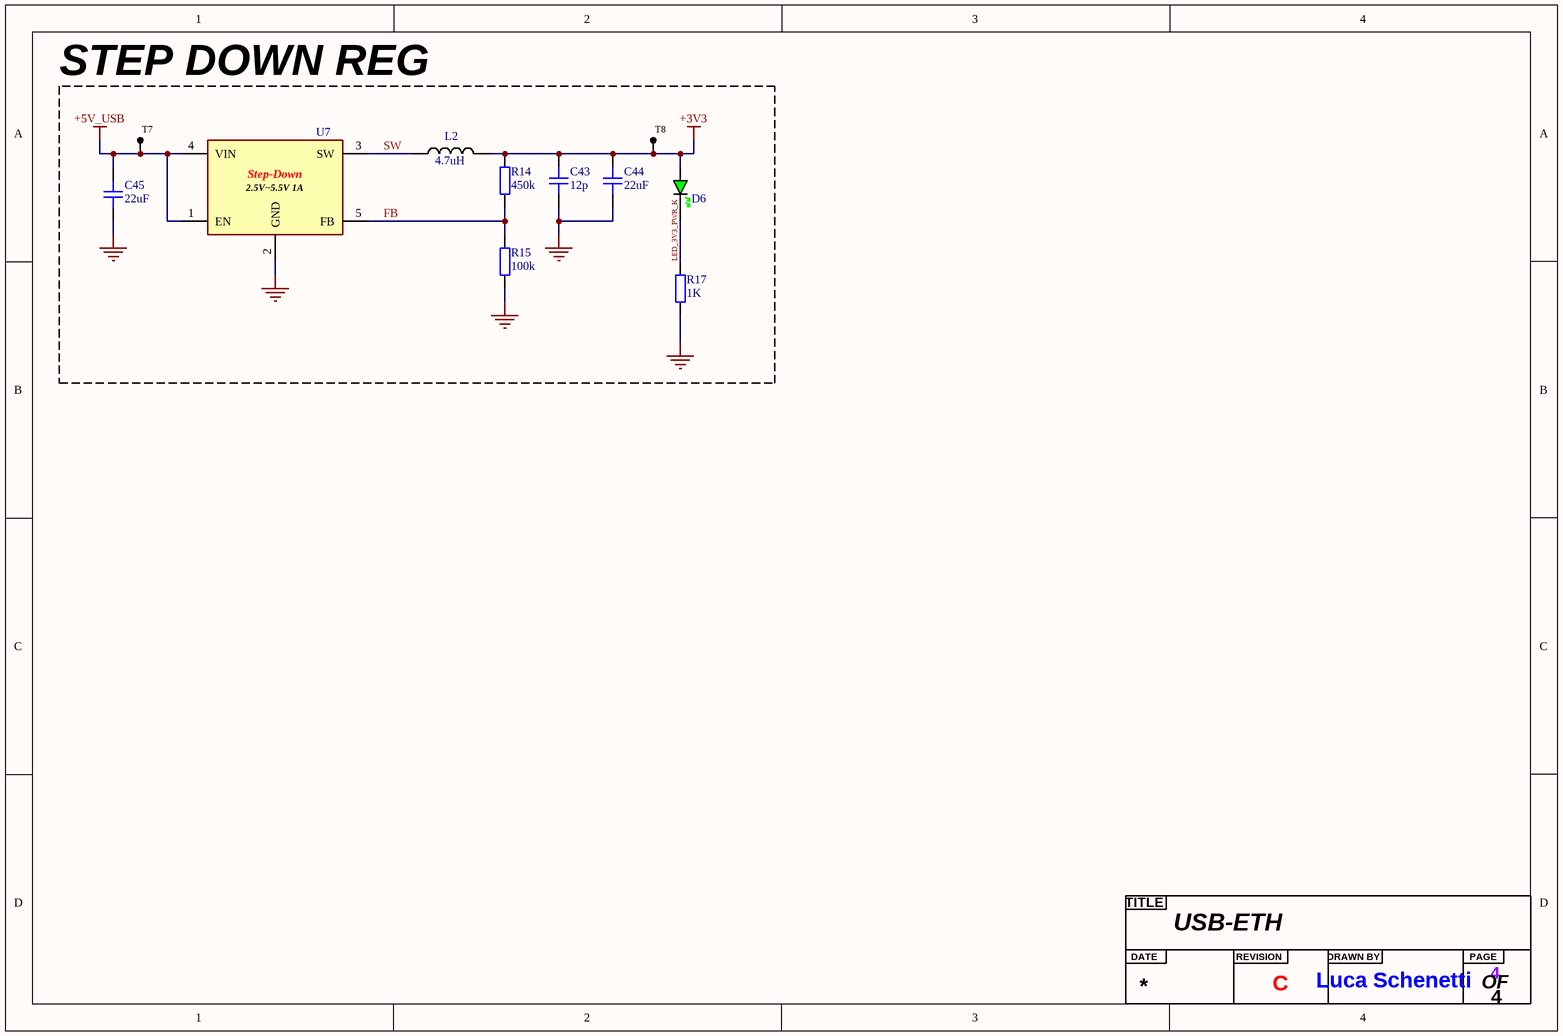
[diagram p5: PWR RAIL.SchDoc]

### Parts
(Parts that share a designator on the sheet are numbered #1, #2 ... from top to bottom, then left to right.)
?#4  Title  (value not drawn)  (graphical)
C43  12p  [CAP_0603]
C44  22uF  [CAP_0603]
C45  22uF  [CAP_0603]
D6  GREEN  [LED_0603_GREEN]  (value not drawn)
L2  4.7uH  [INDUCTOR 1210]
R14  450k  [RES_0402]
R15  100k  [RES_0402]
R17  1K  [RES_0402]
T7  TP_S  [TP 1mm]  (value not drawn)  (no BOM)
T8  TP_S  [TP 1mm]  (value not drawn)  (no BOM)
U7  BUCK CONVERTER 1A 2.5V~5.5V  [TLV62568DBVR]  (value not drawn)

### Blocks framed on the sheet
STEP DOWN REG: C43-C45 D6 L2 R14 R15 R17 T7 T8 U7

### Nets
+3V3: C43.2 C44.2 D6.A L2.2 R14.2 T8.1
+5V_USB: C45.2 T7.1 U7.1(EN) U7.4(VIN)
GND: C43.1 C44.1 C45.1 R15.1 R17.1 U7.2(GND)
FB: R14.1 R15.2 U7.5(FB)
LED_3V3_PWR_K: D6.K R17.2
SW: L2.1 U7.3(SW)

### Notes on the sheet
- (in symbol Title) TITLE; DATE; REVISION; DRAWN BY; PAGE; OF
- (in symbol TLV62568DBVR) Step-Down; 2.5V~5.5V 1A

### Library data of the parts
C43 = CAP_0603: [C38523]; Manufacturer: *; Manufacturer Part Number: *; Distributor Link: *; LCSC: *; Rating: *; Dielectric: *
C44 C45 = CAP_0603: [C59461]; Manufacturer: *; Manufacturer Part Number: *; Distributor Link: *; LCSC: *; Rating: *; Dielectric: *
D6 = LED_0603_GREEN: [C2986059]
L2 = INDUCTOR 1210: [C5832387]
R14 = RES_0402: [C5159688]; Manufacturer: *; Manufacturer Part Number: *; Distributor Link: *; LCSC: *
R15 = RES_0402: [C25741]; Manufacturer: *; Manufacturer Part Number: *; Distributor Link: *; LCSC: *
R17 = RES_0402: [C11702]; Manufacturer: *; Manufacturer Part Number: *; Distributor Link: *; LCSC: *
T7 T8 = TP_S: test point
U7 = TLV62568DBVR: [C163219]

## Nets that join several sheets
+3V3: USB-ETH CHIP (22 pins), USB CONN (17 pins), PWR RAIL (6 pins)
+5V_USB: USB CONN (6 pins), PWR RAIL (C45.2 T7.1 U7.1 U7.4)
GND: USB-ETH CHIP (45 pins), USB CONN (52 pins), PWR RAIL (6 pins)
USB_D_N: USB-ETH CHIP (U3.27), USB CONN (U5.7)
USB_D_P: USB-ETH CHIP (U3.26), USB CONN (U5.8)
USB_SSRX_N: USB-ETH CHIP (U3.32), USB CONN (U4.8)
USB_SSRX_P: USB-ETH CHIP (U3.31), USB CONN (U4.7)
USB_SSTX_N: USB-ETH CHIP (U3.29), USB CONN (U4.3)
USB_SSTX_P: USB-ETH CHIP (U3.28), USB CONN (U4.4)